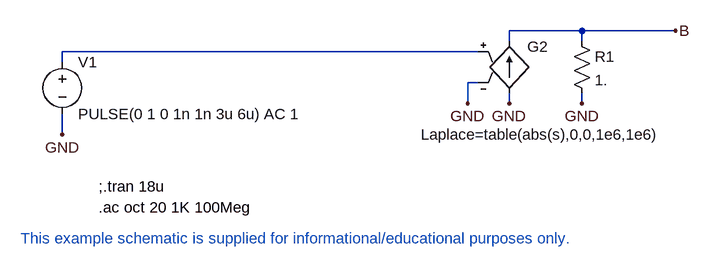
[diagram p0: schematic tbl3.asc]
tbl3.asc, the LTspice schematic file:
Version 4
SHEET 1 1528 896
WIRE 544 592 1184 592
WIRE 544 608 544 592
WIRE 544 688 544 720
WIRE 1232 672 1232 656
WIRE 1344 672 1344 656
WIRE 1232 576 1232 560
WIRE 1232 560 1344 560
WIRE 1344 560 1344 576
WIRE 1184 640 1168 640
WIRE 1168 640 1168 672
WIRE 1344 560 1488 560
FLAG 544 720 GND
FLAG 1344 672 GND
FLAG 1232 672 GND
FLAG 1168 672 GND
FLAG 1488 560 B
SYMBOL VOLTAGE 544 592 R0
SYMATTR InstName V1
SYMATTR Value PULSE(0 1 0 1n 1n 3u 6u) AC 1
SYMBOL G 1232 560 R0
WINDOW 0 28 24 Left 0
WINDOW 3 -136 160 Left 0
SYMATTR InstName G2
SYMATTR Value Laplace=table(abs(s),0,0,1e6,1e6)
SYMBOL RES 1328 560 R0
SYMATTR InstName R1
SYMATTR Value 1.
TEXT 600 832 Left 0 !.ac oct 20 1K 100Meg
TEXT 600 800 Left 0 !;.tran 18u
text 480 880 Left 0 ;This example schematic is supplied for informational/educational purposes only.

The netlist it stands for:
* tbl3.asc
V1 N001 GND PULSE(0 1 0 1n 1n 3u 6u) AC 1
G2 GND B N001 GND Laplace=table(abs(s),0,0,1e6,1e6)
R1 B GND 1.
.ac oct 20 1K 100Meg
;.tran 18u
* This example schematic is supplied for informational/educational purposes only.
.backanno
.end